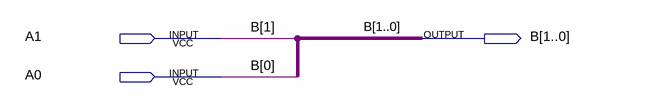
[diagram p0: schematic sheet]
// Quartus schematic bus2.bdf as structural Verilog: 0 symbols, 3 pins
module bus2 (
  input  A1,
  input  A0,
  output [1:0] B
);


  assign B = {A1, A0};
endmodule
